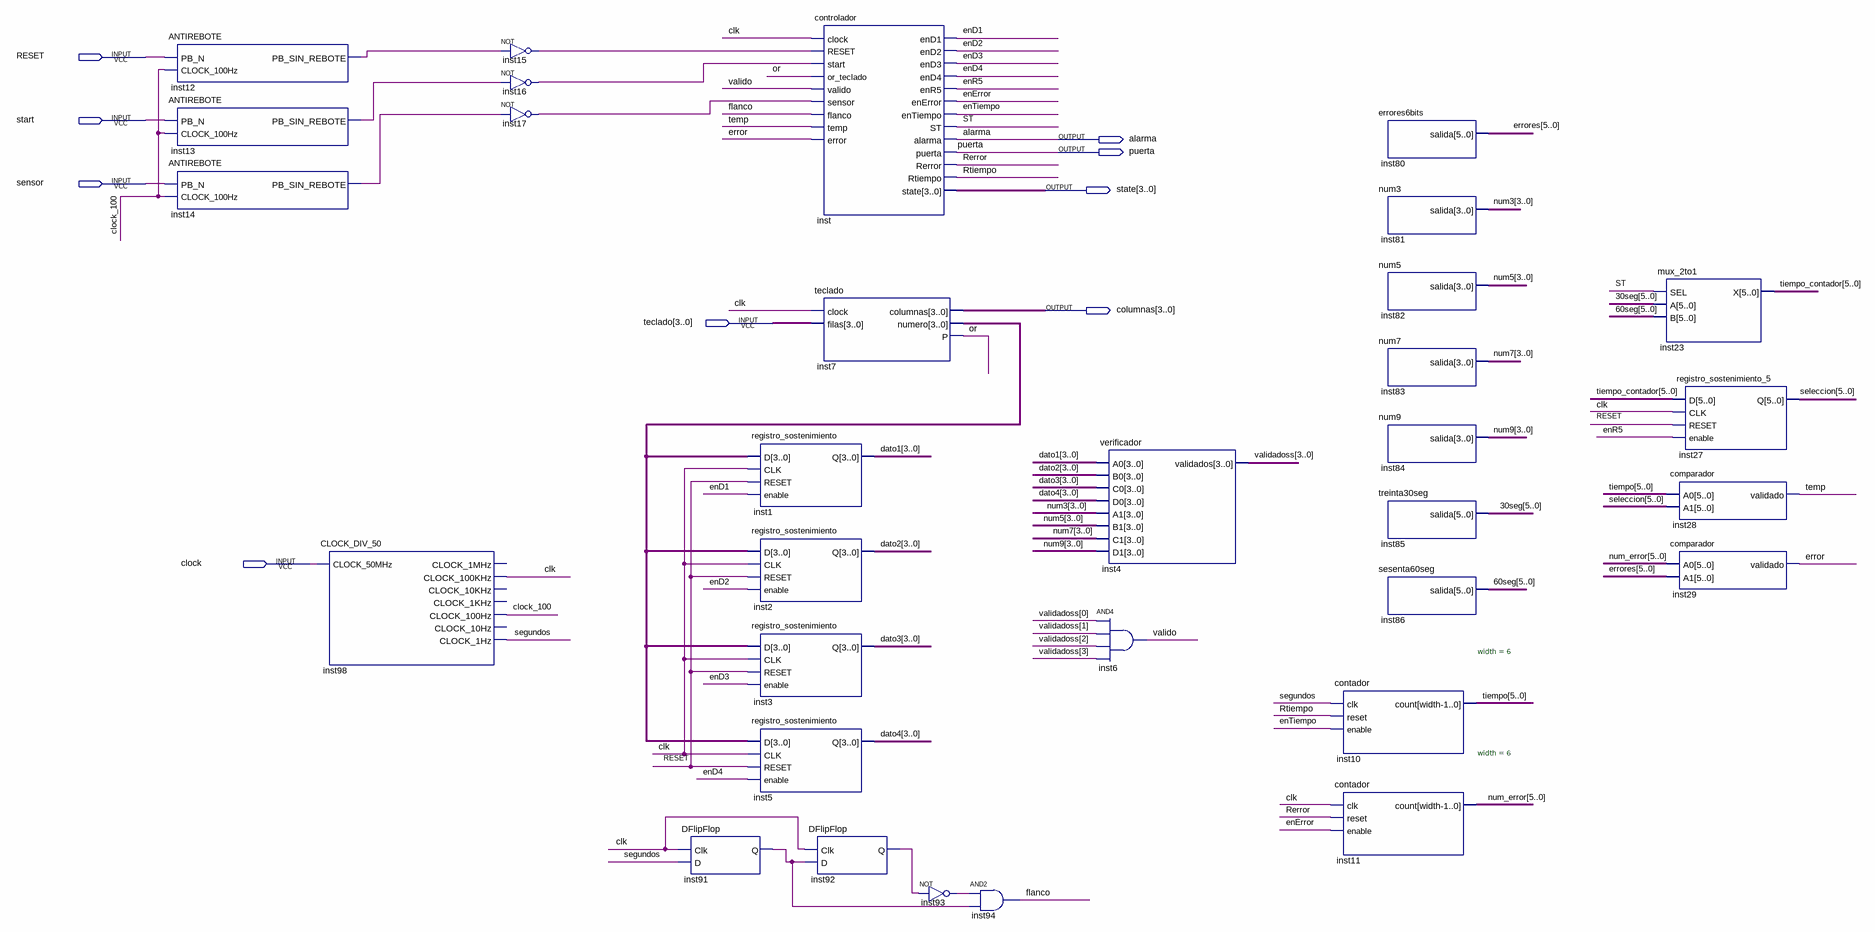
[diagram p0: schematic sheet]
// Quartus schematic Proyecto.bdf as structural Verilog: 32 symbols, 9 pins
module Proyecto (
  input  RESET,
  input  start,
  input  sensor,
  input  [3:0] teclado,
  input  clock,
  output alarma,
  output puerta,
  output [3:0] state,
  output [3:0] columnas
);

  wire clk, clock_100, enD1, enD2, enD3, enD4, enError, enR5, enTiempo, error, flanco, inst12_pb_sin_rebote,
       inst13_pb_sin_rebote, inst14_pb_sin_rebote, inst15_out, inst16_out, inst17_out, inst91_q, inst92_q,
       inst93_out, \or , Rerror, Rtiempo, segundos, ST, temp, valido;
  wire [3:0] dato1, dato2, dato3, dato4, inst7_numero, num3, num5, num7, num9, validadoss;
  wire [5:0] \30seg , \60seg , errores, num_error, seleccion, tiempo, tiempo_contador;

  ANTIREBOTE inst12 (.PB_N(RESET), .CLOCK_100Hz(clock_100), .PB_SIN_REBOTE(inst12_pb_sin_rebote));
  ANTIREBOTE inst13 (.PB_N(start), .CLOCK_100Hz(clock_100), .PB_SIN_REBOTE(inst13_pb_sin_rebote));
  ANTIREBOTE inst14 (.PB_N(sensor), .CLOCK_100Hz(clock_100), .PB_SIN_REBOTE(inst14_pb_sin_rebote));
  CLOCK_DIV_50 inst98 (
    .CLOCK_50MHz(clock), .CLOCK_100KHz(clk), .CLOCK_100Hz(clock_100), .CLOCK_1Hz(segundos));  // open: CLOCK_1MHz, CLOCK_10KHz, CLOCK_1KHz, CLOCK_10Hz
  not inst15 (inst15_out, inst12_pb_sin_rebote);
  not inst16 (inst16_out, inst13_pb_sin_rebote);
  not inst17 (inst17_out, inst14_pb_sin_rebote);
  DFlipFlop inst91 (.Clk(clk), .D(segundos), .Q(inst91_q));
  registro_sostenimiento inst1 (.D(inst7_numero), .CLK(clk), .RESET(RESET), .enable(enD1), .Q(dato1));
  registro_sostenimiento inst2 (.D(inst7_numero), .CLK(clk), .RESET(RESET), .enable(enD2), .Q(dato2));
  registro_sostenimiento inst3 (.D(inst7_numero), .CLK(clk), .RESET(RESET), .enable(enD3), .Q(dato3));
  registro_sostenimiento inst5 (.D(inst7_numero), .CLK(clk), .RESET(RESET), .enable(enD4), .Q(dato4));
  controlador inst (
    .clock(clk), .RESET(inst15_out), .start(inst16_out), .or_teclado(\or ), .valido(valido),
    .sensor(inst17_out), .flanco(flanco), .temp(temp), .error(error), .enD1(enD1), .enD2(enD2), .enD3(enD3),
    .enD4(enD4), .enR5(enR5), .enError(enError), .enTiempo(enTiempo), .ST(ST), .alarma(alarma),
    .puerta(puerta), .Rerror(Rerror), .Rtiempo(Rtiempo), .state(state));
  teclado inst7 (.clock(clk), .filas(teclado), .columnas(columnas), .numero(inst7_numero), .P(\or ));
  DFlipFlop inst92 (.Clk(clk), .D(inst91_q), .Q(inst92_q));
  not inst93 (inst93_out, inst92_q);
  and inst94 (flanco, inst93_out, inst91_q);
  verificador inst4 (
    .A0(dato1), .B0(dato2), .C0(dato3), .D0(dato4), .A1(num3), .B1(num5), .C1(num7), .D1(num9),
    .validados(validadoss));
  and inst6 (valido, validadoss[0], validadoss[1], validadoss[2], validadoss[3]);
  errores6bits inst80 (.salida(errores));
  num3 inst81 (.salida(num3));
  num5 inst82 (.salida(num5));
  num7 inst83 (.salida(num7));
  num9 inst84 (.salida(num9));
  treinta30seg inst85 (.salida(\30seg ));
  sesenta60seg inst86 (.salida(\60seg ));
  contador #(.width(6)) inst10 (.clk(segundos), .reset(Rtiempo), .enable(enTiempo), .count(tiempo));
  contador #(.width(6)) inst11 (.clk(clk), .reset(Rerror), .enable(enError), .count(num_error));
  mux_2to1 inst23 (.SEL(ST), .A(\30seg ), .B(\60seg ), .X(tiempo_contador));
  registro_sostenimiento_5 inst27 (.D(tiempo_contador), .CLK(clk), .RESET(RESET), .enable(enR5), .Q(seleccion));
  comparador inst28 (.A0(tiempo), .A1(seleccion), .validado(temp));
  comparador inst29 (.A0(num_error), .A1(errores), .validado(error));
endmodule
